# EAGLE schematic TugasAkhir (EAGLE 9.6.2)
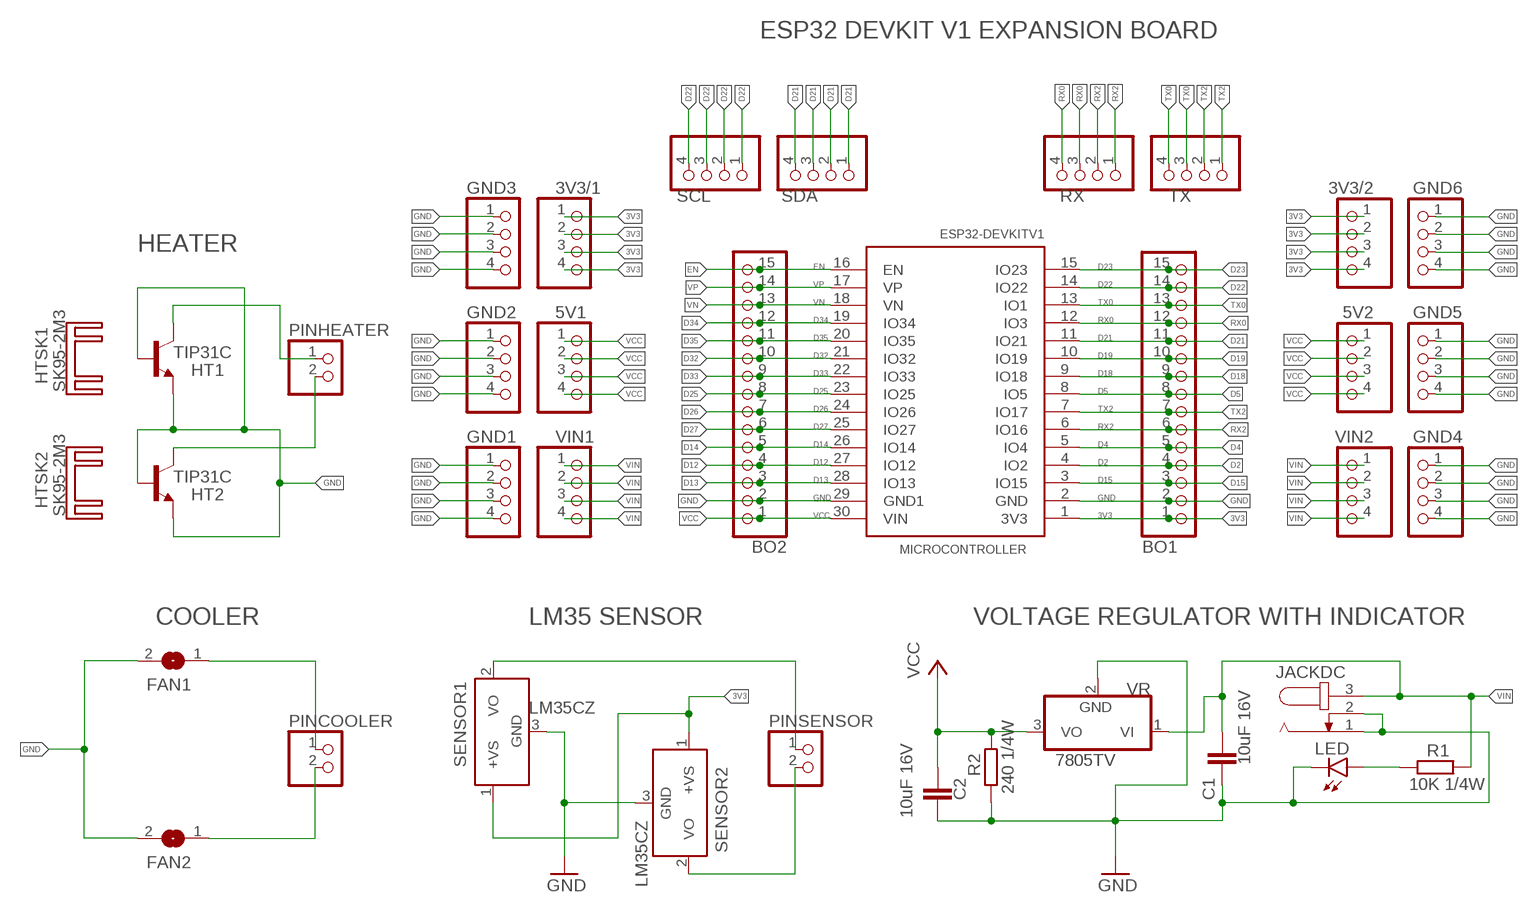
[diagram p0: schematic, sheet 1]

## Parts
3V3/1  PINHD-1X4  [1X04]
3V3/2  PINHD-1X4  [1X04]
5V1  PINHD-1X4  [1X04]
5V2  PINHD-1X4  [1X04]
BO1  PINHD-1X15  [1X15]
BO2  PINHD-1X15  [1X15]
C1  10uF 16V  C-EUC1206K  [C1206K]
C2  10uF 16V  C-EUC1206K  [C1206K]
FAN1  SJW  [SJW]
FAN2  SJW  [SJW]
GND1  PINHD-1X4  [1X04]
GND2  PINHD-1X4  [1X04]
GND3  PINHD-1X4  [1X04]
GND4  PINHD-1X4  [1X04]
GND5  PINHD-1X4  [1X04]
GND6  PINHD-1X4  [1X04]
HT1  TIP31C  [TO220]
HT2  TIP31C  [TO220]
HTSK1  SK95-2M3  [SK95-2M3]
HTSK2  SK95-2M3  [SK95-2M3]
JACKDC  JACK-PLUG1  [SPC4078]
LED  LEDB155  [Q62902-B155]
MICROCONTROLLER  ESP32DEVKITV1  [ESP32-DEVKITV1]
PINCOOLER  PINHD-1X2  [1X02]
PINHEATER  PINHD-1X2  [1X02]
PINSENSOR  PINHD-1X2  [1X02]
R1  10K 1/4W  R-EU_M1206  [M1206]
R2  240 1/4W  R-EU_M1206  [M1206]
RX  PINHD-1X4  [1X04]
SCL  PINHD-1X4  [1X04]
SDA  PINHD-1X4  [1X04]
SENSOR1  LM35CZ  [TO92]
SENSOR2  LM35CZ  [TO92]
TX  PINHD-1X4  [1X04]
VIN1  PINHD-1X4  [1X04]
VIN2  PINHD-1X4  [1X04]
VR  7805TV  [TO220V]

## Nets
3V3: 3V3/1.1 3V3/1.2 3V3/1.3 3V3/1.4 3V3/2.1 3V3/2.2 3V3/2.3 3V3/2.4 BO1.1 MICROCONTROLLER.1(3V3) SENSOR1.1(+VS) SENSOR2.1(+VS)
D2: BO1.4 MICROCONTROLLER.4(IO2)
D4: BO1.5 MICROCONTROLLER.5(IO4)
D5: BO1.8 MICROCONTROLLER.8(IO5)
D12: BO2.4 MICROCONTROLLER.27(IO12)
D13: BO2.3 MICROCONTROLLER.28(IO13)
D14: BO2.5 MICROCONTROLLER.26(IO14)
D15: BO1.3 MICROCONTROLLER.3(IO15)
D18: BO1.9 MICROCONTROLLER.9(IO18)
D19: BO1.10 MICROCONTROLLER.10(IO19)
D21: BO1.11 MICROCONTROLLER.11(IO21) SDA.1 SDA.2 SDA.3 SDA.4
D22: BO1.14 MICROCONTROLLER.14(IO22) SCL.1 SCL.2 SCL.3 SCL.4
D23: BO1.15 MICROCONTROLLER.15(IO23)
D25: BO2.8 MICROCONTROLLER.23(IO25)
D26: BO2.7 MICROCONTROLLER.24(IO26)
D27: BO2.6 MICROCONTROLLER.25(IO27)
D32: BO2.10 MICROCONTROLLER.21(IO32)
D33: BO2.9 MICROCONTROLLER.22(IO33)
D34: BO2.12 MICROCONTROLLER.19(IO34)
D35: BO2.11 MICROCONTROLLER.20(IO35)
EN: BO2.15 MICROCONTROLLER.16(EN)
GND: BO1.2 BO2.2 C1.2 C2.2 FAN1.2 FAN2.2 GND1.1 GND1.2 GND1.3 GND1.4 GND2.1 GND2.2 GND2.3 GND2.4 GND3.1 GND3.2 GND3.3 GND3.4 GND4.1 GND4.2 GND4.3 GND4.4 GND5.1 GND5.2 GND5.3 GND5.4 GND6.1 GND6.2 GND6.3 GND6.4 HT1.1(B) HT1.3(E) HT2.1(B) HT2.3(E) JACKDC.1 JACKDC.2 LED.K(C) MICROCONTROLLER.2(GND) MICROCONTROLLER.29(GND1) R2.1 SENSOR1.3(GND) SENSOR2.3(GND) VR.2(GND)
INF1: FAN1.1 PINCOOLER.1
INF2: FAN2.1 PINCOOLER.2
INH1: HT1.2(C) PINHEATER.1
INH2: HT2.2(C) PINHEATER.2
INL1: PINSENSOR.1 SENSOR1.2(VO)
INL2: PINSENSOR.2 SENSOR2.2(VO)
RX0: BO1.12 MICROCONTROLLER.12(IO3) RX.3 RX.4
RX2: BO1.6 MICROCONTROLLER.6(IO16) RX.1 RX.2
TX0: BO1.13 MICROCONTROLLER.13(IO1) TX.3 TX.4
TX2: BO1.7 MICROCONTROLLER.7(IO17) TX.1 TX.2
VCC: 5V1.1 5V1.2 5V1.3 5V1.4 5V2.1 5V2.2 5V2.3 5V2.4 BO2.1 C2.1 MICROCONTROLLER.30(VIN) R2.2 VR.3(VO)
VIN: C1.1 JACKDC.3 R1.2 VIN1.1 VIN1.2 VIN1.3 VIN1.4 VIN2.1 VIN2.2 VIN2.3 VIN2.4 VR.1(VI)
VN: BO2.13 MICROCONTROLLER.18(VN)
VOUT: LED.A R1.1
VP: BO2.14 MICROCONTROLLER.17(VP)

## Notes on the sheet
- ESP32 DEVKIT V1 EXPANSION BOARD
- HEATER
- COOLER | LM35 SENSOR | VOLTAGE REGULATOR WITH INDICATOR

## Library data of the parts
3V3/1 3V3/2 5V1 5V2 GND1-GND6 RX SCL SDA TX VIN1 VIN2 = pinhead:PINHD-1X4: PIN HEADER
BO1 BO2 = pinhead:PINHD-1X15: PIN HEADER
C1 C2 = rcl:C-EU: CAPACITOR, European symbol; SPICEPREFIX: C
FAN1 FAN2 = jumper:SJ: SMD solder JUMPER
HT1 HT2 = transistor-npn:TIP31C*: NPN Transistor
HTSK1 HTSK2 = heatsink:SK95-2M3: HEATSINK manufacturer Fischer/distributor Buerklin
JACKDC = con-jack:JACK-PLUG: DC POWER JACK Power Jack, DC, Right Angle, Through Hole, Rated 5A at 16VDC, PC Terminals Distributor: Farnell (www.Farnell.de) Drawing: 84N1161.pdf / 84N1162.pdf Manufacturer: SPC Technology (www.spctechnology.com) Type: SPC4077 / SPC 4078; OC_FARNELL: unknown; OC_NEWARK: unknown
LED = led:LED: LED OSRAM: - CHIPLED LG R971, LG N971, LY N971, LG Q971, LY Q971, LO R971, LY R971 LH N974, LH R974 LS Q976, LO Q976, LY Q976 LO Q996 - Hyper CHIPLED LW Q18S LB Q993, LB Q99A, LB R99A - SideLED LS A670, LO A670, LY A670, LG A670, LP A670 LB A673, LV A673, LT A673, LW A673 LH A674 LY A675 LS A676, LA A676, LO A676, LY A676, LW A676 LS A679, LY A679, LG A679 - Hyper Micro SIDELED® LS Y876, LA Y876, LO Y876, LY Y876 LT Y87S - SmartLED LW L88C, LW L88S LB L89C, LB L89S, LG L890 LS L89K, LO L89K, LY L89K LS L896, LA L896, LO L896, LY L896 - TOPLED LS T670, LO T670, LY T670, LG T670, LP T670 LSG T670, LSP T670, LSY T670, LOP T670, LYG T670 LG T671, LOG T671, LSG T671 LB T673, LV T673, LT T673, LW T673 LH T674 LS T676, LA T676, LO T676, LY T676, LB T676, LH T676, LSB T676, LW T676 LB T67C, LV T67C, LT T67C, LS T67K, LO T67K, LY T67K, LW E67C LS E67B, LA E67B, LO E67B, LY E67B, LB E67C, LV E67C, LT E67C LW T67C LS T679, LY T679, LG T679 LS T770, LO T770, LY T770, LG T770, LP T770 LB T773, LV T773, LT T773, LW T773 LH T774 LS E675, LA E675, LY E675, LS T675 LS T776, LA T776, LO T776, LY T776, LB T776 LHGB T686 LT T68C, LB T68C - Hyper Mini TOPLED® LB M676 - Mini TOPLED Santana® LG M470 LS M47K, LO M47K, LY M47K Source: http://www.osram.convergy.de LUXEON: - LUMILED® LXK2-PW12-R00, LXK2-PW12-S00, LXK2-PW14-U00, LXK2-PW14-V00 LXK2-PM12-R00, LXK2-PM12-S00, LXK2-PM14-U00 LXK2-PE12-Q00, LXK2-PE12-R00, LXK2-PE12-S00, LXK2-PE14-T00, LXK2-PE14-U00 LXK2-PB12-K00, LXK2-PB12-L00, LXK2-PB12-M00, LXK2-PB14-N00, LXK2-PB14-P00, LXK2-PB14-Q00 LXK2-PR12-L00, LXK2-PR12-M00, LXK2-PR14-Q00, LXK2-PR14-R00 LXK2-PD12-Q00, LXK2-PD12-R00, LXK2-PD12-S00 LXK2-PH12-R00, LXK2-PH12-S00 LXK2-PL12-P00, LXK2-PL12-Q00, LXK2-PL12-R00 Source: www.luxeon.com KINGBRIGHT: KA-3528ASYC Source: www.kingbright.com
MICROCONTROLLER = ESP32-DEVKITV1:ESP32DEVKITV1
PINCOOLER PINHEATER PINSENSOR = pinhead:PINHD-1X2: PIN HEADER
R1 R2 = rcl:R-EU_: RESISTOR, European symbol; SPICEPREFIX: R
SENSOR1 SENSOR2 = lm35:LM35: Single-Supply Centigrade Temperature Sensor Vout = (10mV/°C x Temp °C) +5mmmV Source: http://www.national.com/ds/LM/LM35.pdf
VR = linear:78*: Positive VOLTAGE REGULATOR Source: http://cache.national.com/ds/LM/LM78L05.pdf http://www.fairchildsemi.com/ds/LM/LM7805.pdf